# Altium schematic sheet Astranis.SchDoc
size A
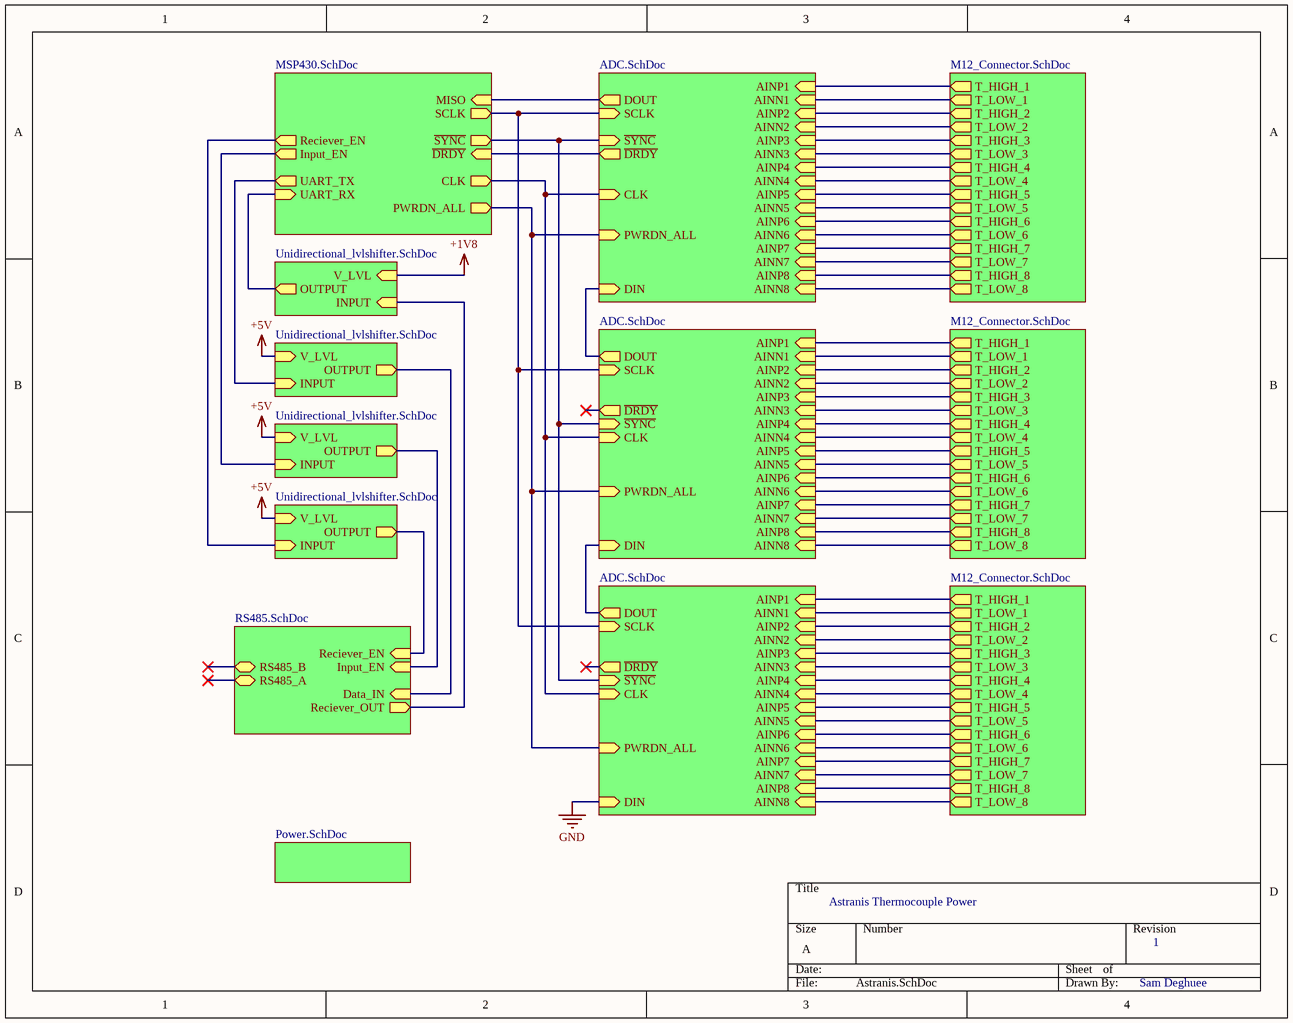
[diagram p0: Astranis.SchDoc]

## Sub-sheets
Designator = MSP430.SchDoc: UART_TX (out), UART_RX (in), MISO (in), SCLK (out), PWRDN_ALL (out), ~{DRDY} (in), Input_EN (out), Reciever_EN (out), CLK (out), ~{SYNC} (out)
Designator = ADC.SchDoc: SCLK (in), ~{DRDY} (out), AINN8 (in), AINP3 (in), AINP5 (in), AINP7 (in), AINN7 (in), AINN5 (in), AINP2 (in), DOUT (out), PWRDN_ALL (in), AINN3 (in), AINN4 (in), AINN2 (in), AINN6 (in), AINP4 (in), AINP1 (in), ~{SYNC} (in), AINN1 (in), AINP6 (in), AINP8 (in), DIN (in), CLK (in)
Designator = M12_Connector.SchDoc: T_HIGH_1 (out), T_HIGH_5 (out), T_LOW_1 (out), T_HIGH_7 (out), T_LOW_2 (out), T_HIGH_4 (out), T_LOW_8 (out), T_LOW_3 (out), T_LOW_6 (out), T_HIGH_3 (out), T_HIGH_2 (out), T_HIGH_6 (out), T_LOW_7 (out), T_LOW_5 (out), T_LOW_4 (out), T_HIGH_8 (out)
Designator = ADC.SchDoc: SCLK (in), ~{DRDY} (out), AINN8 (in), AINP3 (in), AINP5 (in), AINP7 (in), AINN7 (in), AINN5 (in), AINP2 (in), DOUT (out), PWRDN_ALL (in), AINN3 (in), AINN4 (in), AINN2 (in), AINN6 (in), AINP4 (in), AINP1 (in), ~{SYNC} (in), AINN1 (in), AINP6 (in), AINP8 (in), DIN (in), CLK (in)
Designator = M12_Connector.SchDoc: T_HIGH_1 (out), T_HIGH_5 (out), T_LOW_1 (out), T_HIGH_7 (out), T_LOW_2 (out), T_HIGH_4 (out), T_LOW_8 (out), T_LOW_3 (out), T_LOW_6 (out), T_HIGH_3 (out), T_HIGH_2 (out), T_HIGH_6 (out), T_LOW_7 (out), T_LOW_5 (out), T_LOW_4 (out), T_HIGH_8 (out)
Designator = ADC.SchDoc: SCLK (in), ~{DRDY} (out), AINN8 (in), AINP3 (in), AINP5 (in), AINP7 (in), AINN7 (in), AINN5 (in), AINP2 (in), DOUT (out), PWRDN_ALL (in), AINN3 (in), AINN4 (in), AINN2 (in), AINN6 (in), AINP4 (in), AINP1 (in), ~{SYNC} (in), AINN1 (in), AINP6 (in), AINP8 (in), DIN (in), CLK (in)
Designator = M12_Connector.SchDoc: T_HIGH_1 (out), T_HIGH_5 (out), T_LOW_1 (out), T_HIGH_7 (out), T_LOW_2 (out), T_HIGH_4 (out), T_LOW_8 (out), T_LOW_3 (out), T_LOW_6 (out), T_HIGH_3 (out), T_HIGH_2 (out), T_HIGH_6 (out), T_LOW_7 (out), T_LOW_5 (out), T_LOW_4 (out), T_HIGH_8 (out)
Designator = Unidirectional_lvlshifter.SchDoc: V_LVL (in), OUTPUT (out), INPUT (in)
Designator = Unidirectional_lvlshifter.SchDoc: V_LVL (in), OUTPUT (out), INPUT (in)
Designator = RS485.SchDoc: RS485_B (bidir), Input_EN (in), Reciever_EN (in), Reciever_OUT (out), Data_IN (in), RS485_A (bidir)
Designator = Unidirectional_lvlshifter.SchDoc: V_LVL (in), OUTPUT (out), INPUT (in)
Designator = Unidirectional_lvlshifter.SchDoc: V_LVL (in), OUTPUT (out), INPUT (in)
Designator = Power.SchDoc: no entries

## Nets
+1V8: sheet Designator/V_LVL
+5V: sheet Designator/V_LVL, sheet Designator/V_LVL, sheet Designator/V_LVL
GND: sheet Designator/DIN
(unnamed): sheet Designator/UART_TX, sheet Designator/INPUT
(unnamed): sheet Designator/UART_RX, sheet Designator/OUTPUT
(unnamed): sheet Designator/MISO, sheet Designator/DOUT
(unnamed): sheet Designator/SCLK, sheet Designator/SCLK, sheet Designator/SCLK, sheet Designator/SCLK
(unnamed): sheet Designator/PWRDN_ALL, sheet Designator/PWRDN_ALL, sheet Designator/PWRDN_ALL, sheet Designator/PWRDN_ALL
(unnamed): sheet Designator/~{DRDY}, sheet Designator/~{DRDY}
(unnamed): sheet Designator/Input_EN, sheet Designator/INPUT
(unnamed): sheet Designator/Reciever_EN, sheet Designator/INPUT
(unnamed): sheet Designator/CLK, sheet Designator/CLK, sheet Designator/CLK, sheet Designator/CLK
(unnamed): sheet Designator/~{SYNC}, sheet Designator/~{SYNC}, sheet Designator/~{SYNC}, sheet Designator/~{SYNC}
(unnamed): sheet Designator/AINN8, sheet Designator/T_LOW_8
(unnamed): sheet Designator/AINP3, sheet Designator/T_HIGH_3
(unnamed): sheet Designator/AINP5, sheet Designator/T_HIGH_5
(unnamed): sheet Designator/AINP7, sheet Designator/T_HIGH_7
(unnamed): sheet Designator/AINN7, sheet Designator/T_LOW_7
(unnamed): sheet Designator/AINN5, sheet Designator/T_LOW_5
(unnamed): sheet Designator/AINP2, sheet Designator/T_HIGH_2
(unnamed): sheet Designator/AINN3, sheet Designator/T_LOW_3
(unnamed): sheet Designator/AINN4, sheet Designator/T_LOW_4
(unnamed): sheet Designator/AINN2, sheet Designator/T_LOW_2
(unnamed): sheet Designator/AINN6, sheet Designator/T_LOW_6
(unnamed): sheet Designator/AINP4, sheet Designator/T_HIGH_4
(unnamed): sheet Designator/AINP1, sheet Designator/T_HIGH_1
(unnamed): sheet Designator/AINN1, sheet Designator/T_LOW_1
(unnamed): sheet Designator/AINP6, sheet Designator/T_HIGH_6
(unnamed): sheet Designator/AINP8, sheet Designator/T_HIGH_8
(unnamed): sheet Designator/DIN, sheet Designator/DOUT
(unnamed): sheet Designator/AINN8, sheet Designator/T_LOW_8
(unnamed): sheet Designator/AINP3, sheet Designator/T_HIGH_3
(unnamed): sheet Designator/AINP5, sheet Designator/T_HIGH_5
(unnamed): sheet Designator/AINP7, sheet Designator/T_HIGH_7
(unnamed): sheet Designator/AINN7, sheet Designator/T_LOW_7
(unnamed): sheet Designator/AINN5, sheet Designator/T_LOW_5
(unnamed): sheet Designator/AINP2, sheet Designator/T_HIGH_2
(unnamed): sheet Designator/AINN3, sheet Designator/T_LOW_3
(unnamed): sheet Designator/AINN4, sheet Designator/T_LOW_4
(unnamed): sheet Designator/AINN2, sheet Designator/T_LOW_2
(unnamed): sheet Designator/AINN6, sheet Designator/T_LOW_6
(unnamed): sheet Designator/AINP4, sheet Designator/T_HIGH_4
(unnamed): sheet Designator/AINP1, sheet Designator/T_HIGH_1
(unnamed): sheet Designator/AINN1, sheet Designator/T_LOW_1
(unnamed): sheet Designator/AINP6, sheet Designator/T_HIGH_6
(unnamed): sheet Designator/AINP8, sheet Designator/T_HIGH_8
(unnamed): sheet Designator/DIN, sheet Designator/DOUT
(unnamed): sheet Designator/AINN8, sheet Designator/T_LOW_8
(unnamed): sheet Designator/AINP3, sheet Designator/T_HIGH_3
(unnamed): sheet Designator/AINP5, sheet Designator/T_HIGH_5
(unnamed): sheet Designator/AINP7, sheet Designator/T_HIGH_7
(unnamed): sheet Designator/AINN7, sheet Designator/T_LOW_7
(unnamed): sheet Designator/AINN5, sheet Designator/T_LOW_5
(unnamed): sheet Designator/AINP2, sheet Designator/T_HIGH_2
(unnamed): sheet Designator/AINN3, sheet Designator/T_LOW_3
(unnamed): sheet Designator/AINN4, sheet Designator/T_LOW_4
(unnamed): sheet Designator/AINN2, sheet Designator/T_LOW_2
(unnamed): sheet Designator/AINN6, sheet Designator/T_LOW_6
(unnamed): sheet Designator/AINP4, sheet Designator/T_HIGH_4
(unnamed): sheet Designator/AINP1, sheet Designator/T_HIGH_1
(unnamed): sheet Designator/AINN1, sheet Designator/T_LOW_1
(unnamed): sheet Designator/AINP6, sheet Designator/T_HIGH_6
(unnamed): sheet Designator/AINP8, sheet Designator/T_HIGH_8
(unnamed): sheet Designator/INPUT, sheet Designator/Reciever_OUT
(unnamed): sheet Designator/OUTPUT, sheet Designator/Data_IN
(unnamed): sheet Designator/Input_EN, sheet Designator/OUTPUT
(unnamed): sheet Designator/Reciever_EN, sheet Designator/OUTPUT

## Notes on the sheet
- Astranis Thermocouple Power
- 1
- Sam Deghuee